# Altium schematic sheet Test.SchDoc
size A4; SheetNumber: 1; SheetTotal: 1
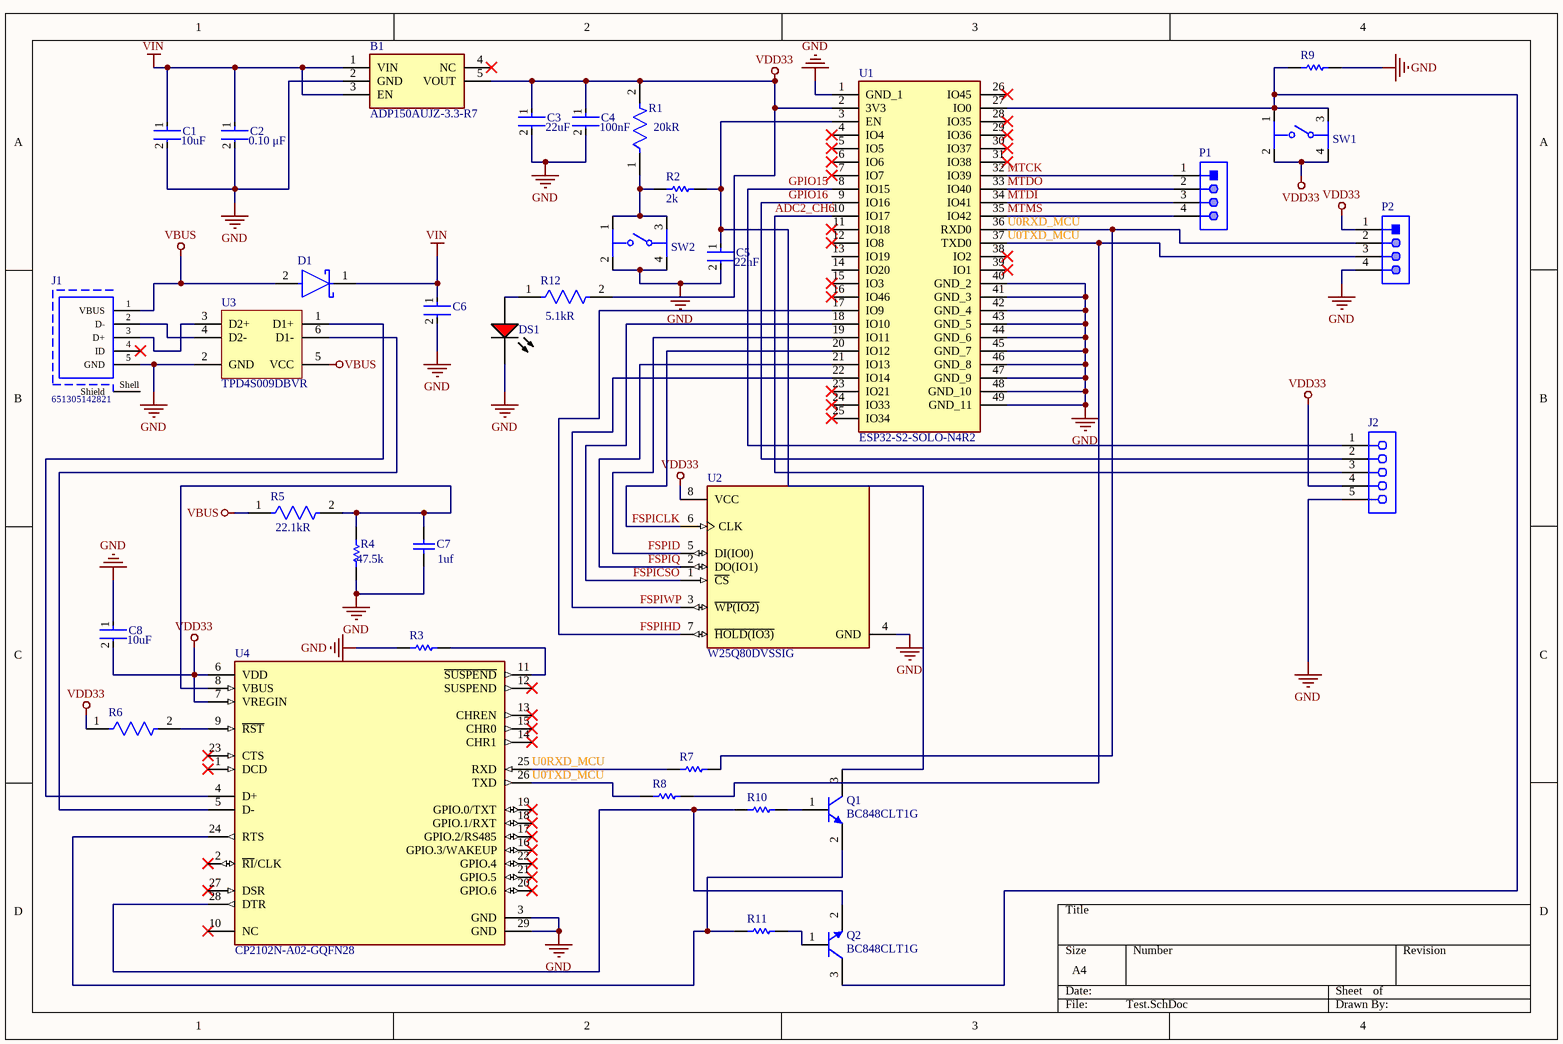
[diagram p0: Test.SchDoc]

## Parts
B1  ADP150AUJZ-3.3-R7  [SOT95P280X100-5N]
C1  Capacitance: 10uF  [FP-GRM21B-0_1-IPC_C]  (hidden comment: GRM21BR61C106KE15L)
C2  Capacitance: 0.10 μF  [FP-C1206C-EB-MFG]  (hidden comment: C1206C104K1RACTU)
C3  Capacitance: 22uF  [FP-GRM21B-0_15-MFG]  (hidden comment: GRM21BR60J226ME39L)
C4  Capacitance: 100nF  [FP-CL03-IPC_B]  (hidden comment: CL03A104KQ3NNNH)
C5  Capacitance: 22nF  [FP-CL21-IPC_A]  (hidden comment: CL21B223KBANNNC)
C6  GRM21BR61E106KA73L  [FP-GRM21B-0_15-IPC_C]  (value not drawn)
C7  value 1uf  [CAPC2013X145X50LL20T25]  (hidden comment: C0805C105K4PACTU)
C8  Capacitance: 10uF  [FP-GRM21B-0_1-IPC_C]  (hidden comment: GRM21BR61C106KE15L)
D1  MSS1P4-M3/89A  [FP-96591-MFG]  (value not drawn)
DS1  TLMS1100-GS08  [VISH-TLMX1100_V]  (value not drawn)
J1  651305142821  [651305142821]
J2  SSW-105-01-G-S  [SMTC-SSW-105-01-X-S]  (value not drawn)
P1  61300411121  [61300411121]  (value not drawn)
P2  61300411121  [61300411121]  (value not drawn)
Q1  BC848CLT1G  [ONSC-SOT-23-3-318-08_V]
Q2  BC848CLT1G  [ONSC-SOT-23-3-318-08_V]
R1  Resistance: 20kR  [FP-AC0603-MFG]  (hidden comment: AC0603FR-0720KL)
R2  Resistance (Ohms): 2k  [RESC1608X55X25LL10T15]  (hidden comment: RC0603FR-072KL)
R3  ERJ3EKF1002V  [RESC1609X55X30LL15T15]  (value not drawn)
R4  value 47.5k  [RESC1609X50X30LL10T20]  (hidden comment: CRCW060347K5FKEA)
R5  Resistance: 22.1kR  [FP-RC0402-0_4-IPC_B]  (hidden comment: RC0402FR-0722K1L)
R6  AC0603FR-071KL  [FP-AC0603-MFG]  (value not drawn)
R7  RC0603JR-070RL  [RESC1608X55X25ML10T15]  (value not drawn)
R8  RC0603JR-070RL  [RESC1608X55X25ML10T15]  (value not drawn)
R9  ERJ3EKF1002V  [RESC1609X55X30LL15T15]  (value not drawn)
R10  ERJ3EKF1002V  [RESC1609X55X30LL15T15]  (value not drawn)
R11  ERJ3EKF1002V  [RESC1609X55X30LL15T15]  (value not drawn)
R12  Resistance: 5.1kR  [FP-CR1206-IPC_B]  (hidden comment: CR1206-FX-5101ELF)
SW1  PTS810 SJG 250 SMTR LFS  [FP-PTS810_SJG_250_SMTR_LF-MFG]  (value not drawn)
SW2  PTS810 SJG 250 SMTR LFS  [FP-PTS810_SJG_250_SMTR_LF-MFG]  (value not drawn)
U1  ESP32-S2-SOLO-N4R2  [ESP32S2SOLON4R2]
U2  W25Q80DVSSIG  [FP-SS-MFG]
U3  TPD4S009DBVR  [DBV0006A_L]
U4  CP2102N-A02-GQFN28  [FP-CP2102N-A02-GQFN28-MFG]

## Nets
GND: B1.2(GND) C1.2 C2.2 C3.2 C4.2 C5.2 C6.2 C7.1 C8.1 DS1.2(K) J1.5(GND) J2.5 P2.4 R3.1 R4.1 R9.2 SW2.2 SW2.4 U1.1(GND_1) U1.40(GND_2) U1.41(GND_3) U1.42(GND_4) U1.43(GND_5) U1.44(GND_6) U1.45(GND_7) U1.46(GND_8) U1.47(GND_9) U1.48(GND_10) U1.49(GND_11) U2.4(GND) U3.2(GND) U4.3(GND) U4.29(GND)
VBUS: D1.2(A) J1.1(VBUS) R5.1 U3.5(VCC)
VDD33: B1.5(VOUT) C3.1 C4.1 C8.2 J2.4 P2.1 R1.2 R6.1 R12.2 SW1.2 SW1.4 U1.2(3V3) U2.8(VCC) U4.6(VDD) U4.7(VREGIN)
VIN: B1.1(VIN) B1.3(EN) C1.1 C2.1 C6.1 D1.1(C)
ADC2_CH6: J2.3 U1.10(IO17)
FSPICLK: U1.20(IO12) U2.6(CLK)
FSPICSO: U1.18(IO10) U2.1(~{CS})
FSPID: U1.19(IO11) U2.5(DI(IO0))
FSPIHD: U1.17(IO9) U2.7(~{HOLD(IO3)})
FSPIQ: U1.21(IO13) U2.2(DO(IO1))
FSPIWP: U1.22(IO14) U2.3(~{WP(IO2)})
GPIO15: J2.1 U1.8(IO15)
GPIO16: J2.2 U1.9(IO16)
MTCK: P1.1 U1.32(IO39)
MTDI: P1.3 U1.34(IO41)
MTDO: P1.2 U1.33(IO40)
MTMS: P1.4 U1.35(IO42)
U0RXD_MCU: P2.2 R7.1 R7.2 U1.36(RXD0) U4.25(RXD)
U0TXD_MCU: P2.3 R8.1 R8.2 U1.37(TXD0) U4.26(TXD)
NetC5_1: C5.1 Q1.3(C) R2.1 U1.3(EN)
NetC7_2: C7.2 R4.2 R5.2 U4.8(VBUS)
NetDS1_1: DS1.1(A) R12.1
NetJ1_2: J1.2(D-) U3.4(D2-)
NetJ1_3: J1.3(D+) U3.3(D2+)
NetQ1_1: Q1.1(B) R10.2
NetQ1_2: Q1.2(E) R11.1 U4.24(RTS)
NetQ2_1: Q2.1(B) R11.2
NetQ2_2: Q2.2(E) R10.1 U4.28(DTR)
NetQ2_3: Q2.3(C) R9.1 SW1.1 SW1.3 U1.27(IO0)
NetR1_1: R1.1 R2.2 SW2.1 SW2.3
NetR3_2: R3.2 U4.11(~{SUSPEND})
NetR6_2: R6.2 U4.9(~{RST})
NetU3_1: U3.1(D1+) U4.4(D+)
NetU3_6: U3.6(D1-) U4.5(D-)

Not connected (* = marked no-connect by the designer): B1 4(NC)*; J1 4(ID)* Shell(Shield); U1 4(IO4)* 5(IO5)* 6(IO6)* 7(IO7)* 11(IO18)* 12(IO8)* 13(IO19) 14(IO20) 15(IO3)* 16(IO46)* 23(IO21)* 24(IO33)* 25(IO34)* 26(IO45)* 28(IO35)* 29(IO36)* 30(IO37)* 31(IO38)* 38(IO2)* 39(IO1)*; U4 1(DCD)* 2(~{RI}/CLK)* 10(NC)* 12(SUSPEND)* 13(CHREN)* 14(CHR1)* 15(CHR0)* 16(GPIO.3/WAKEUP)* 17(GPIO.2/RS485)* 18(GPIO.1/RXT)* 19(GPIO.0/TXT)* 20(GPIO.6)* 21(GPIO.5)* 22(GPIO.4)* 23(CTS)* 27(DSR)*

## Library data of the parts
B1 = ADP150AUJZ-3.3-R7: Ultralow Noise, 150 mA CMOS Linear Regulator; Manufacturer_Name: Analog Devices; Geometry.Height: 1mm; Mouser Part Number: N/A; Mouser Price/Stock: https://www.mouser.com/Search/Refine.aspx?Keyword=N%2FA; Manufacturer_Part_Number: ADP150AUJZ-3.3-R7; Datasheet Link: https://componentsearchengine.com/Datasheets/1/ADP150AUJZ-3.3-R7.pdf
C1 C8 = CMP-2007-03453-2: Chip Multilayer Ceramic Capacitors for General Purpose, 0805, 10uF, X5R, 15%, 10%, 16V; Radiation Hardening: No; Thickness: 0.053inch; Voltage Rating (DC): 16V; Lead Free: Lead Free; Package Quantity: 1; Width: 1.25mm; Case Code (Imperial): 0805; Depth: 1.25mm; Packaging: Tape and Reel; Dielectric: X5R; Max Operating Temperature: 85°C; Tolerance: 10%; Voltage Rating: 16V; Voltage: 16V; Height: 1.25mm; Case Code (Metric): 2012; Material: Ceramic; Mount: Surface Mount; Case/Package: 0805; REACH SVHC: No SVHC; Length: 2mm; Min Operating Temperature: -55°C; Termination: SMD/SMT
C2 = CMP-03020-000153-1: CAP CER 0.1UF 100V X7R 1206; Manufacturer: KEMET; Value: 0.10 μF; Tolerance: 0.1; Material: Ceramic; Temperature Coefficient: 15%; Automotive Grade: Grade 0; Voltage Rating: 100 V; Automotive: Yes; Ipc Land Pattern Name: CAPC320160X78; Device Class L1: Passive Components; ComponentLink2Description: Datasheet; Temperature Range Low: -55°C; Category: Cap; Octopart: https://octopart.com/c1206c104k1ractu-kemet-89521; Height: 0.88mm; Lead Free: Yes; Digikey Description: CAP CER 0.1UF 100V X7R 1206; Mouser Description: CAP CER 0.1UF 100V X7R 1206; Device Class L3: Ceramic Capacitors; Device Class L2: Capacitors; ComponentLink2URL: https://content.kemet.com/datasheets/KEM_C1007_X8R_ULTRA_150C_SMD.pdf; Temperature Range High: +150°C; Temperature Characteristic: X7R; Manufacturer Part Number: C1206C104K1RACTU; RoHS: TRUE; Package: C1206C-EB; Temperature: -55°C to +150°C
C3 = CMP-2007-03385-2: Chip Multilayer Ceramic Capacitors for General Purpose, 0805, 22uF, X5R, 15%, 20%, 6.3V; Material: Ceramic; Max Operating Temperature: 85°C; Voltage: 6.3V; Min Operating Temperature: -55°C; Case/Package: 0805; Thickness: 0.053inch; Dielectric: X5R; Packaging: Tape and Reel; Depth: 1.25mm; Termination: SMD/SMT; Voltage Rating (DC): 6.3V; Radiation Hardening: No; Tolerance: 20%; Mount: Surface Mount; Lead Free: Lead Free; Package Quantity: 1; REACH SVHC: No SVHC; Voltage Rating: 6.3V; Length: 2mm; Case Code (Imperial): 0805; Case Code (Metric): 2012; Width: 0.049inch; Height: 1.25mm
C4 = CMP-13271-001518-1: Cap Ceramic 100nF 6.3V X5R ±10% Pad SMD 0201 +85°C T/R; Case Code (Metric): 0603; Radiation Hardening: No; Height: 0.3mm; Tolerance: 10%; Max Operating Temperature: 85°C; Thickness: 0.013inch; Voltage Rating: 6.3V; Dielectric: X5R; Depth: 0.3mm; Mount: Surface Mount; Min Operating Temperature: -55°C; Width: 0.012inch; Case Code (Imperial): 0201; Packaging: Tape and Reel; Length: 0.6mm; Case/Package: 0201; Package Quantity: 15000
C5 = CMP-13271-002911-1: CL21 Series 0805 22nF 50V ±10% Tolerance X7R Multilayer Ceramic Chip Capacitor; Depth: 1.25mm; Thickness: 0.03inch; Height: 0.65mm; Material: Ceramic; Case/Package: 0805; Voltage Rating (DC): 50V; Contact Plating: Tin; Package Quantity: 1; Case Code (Metric): 2012; Max Operating Temperature: 125°C; Packaging: Tape and Reel; Voltage Rating: 50V; Radiation Hardening: No; Length: 2mm; Mount: Surface Mount; Min Operating Temperature: -55°C; Tolerance: 10%; Case Code (Imperial): 0805; Voltage: 50V; Dielectric: X7R; Lead Free: Lead Free; Width: 0.049inch
C6 = CMP-2007-03541-2: Chip Multilayer Ceramic Capacitors for General Purpose, 0805, 10uF, X5R, 15%, 10%, 25V; Length: 2mm; Depth: 1.25mm; Termination: SMD/SMT; Voltage: 25V; Height: 1.25mm; Material: Ceramic; Thickness: 0.053inch; Radiation Hardening: No; Min Operating Temperature: -55°C; Width: 0.049inch; Package Quantity: 1; Mount: Surface Mount; Dielectric: X5R; Packaging: Tape and Reel; Capacitance: 10uF; Voltage Rating (DC): 25V; Lead Free: Lead Free; Max Operating Temperature: 85°C; Case Code (Imperial): 0805; Case/Package: 0805; Tolerance: 10%; Voltage Rating: 25V; Case Code (Metric): 2012
C7 = CMP-1036-04746-2: Manufacturer: Kemet; Part Number: C0805C105K4PACTU
D1 = CMP-02539-000019-1: DIODE SCHOTTKY 40V 1A MICROSMP; Manufacturer: Vishay; Value: 50pF; Peak Reverse Current: 8.5uA; Max Junction Temp: +150°C; Max Surge Forward Current: 25A; Mouser Description: Schottky Diodes & Rectifiers 1.0 Amp 40 Volt; Category: Diode; Height: 0.73mm; Temperature Range High: +150°C; Temperature Range Low: -55°C; ComponentLink2URL: http://www.vishay.com/docs/89019/mss1p4.pdf; Forward Current: 1A; Device Class L1: Discrete Semiconductors; Lead Free: Yes; Octopart: https://octopart.com/mss1p4-m3%2F89a-vishay-42505723; ComponentLink2Description: Datasheet; Digikey Description: DIODE SCHOTTKY 40V 1A MICROSMP; Footprint Url: http://www.vishay.com/docs/96591/microsmp_do-219ad_fredpt.pdf; Package: 96591; Temperature: -55°C to +150°C; Device Class L2: Diodes; Manufacturer Part Number: MSS1P4-M3/89A; Automotive: No; RoHS: TRUE; Device Class L3: Schottky Diodes; Capacitance: 50pF; Max Repetitive Reverse Voltage: 40V
DS1 = CMP-1666-00027-1: LED, RED, 2.1 V, -40 to 100 degC, 2-Pin SMD (0603), RoHS, Tape and Reel; Type (Capacitors): C0G; Resistance: 100000000000 Ohm; Capacitance: 12 pF; Voltage Rating: 50 V; Tolerance: 5%; Min Operating Temperature: -55degC; REACH SVHC: No SVHC; ComponentLink2Description: Datasheet; ComponentLink1URL: http://www.vishay.com/; Width: 0.8 mm; Package Quantity: 4000; PackageReference: TLMX1100; ComponentLink2URL: http://www.vishay.com/docs/83173/tlmb1100.pdf; Case/Package: 0603; Case Code (Metric): 1608; Packaging: Tape and Reel; Pins: 2; ComponentLink1Description: Manufacturer URL; Max Operating Temperature: 125degC; Height: 0.8 mm; Length: 1.6 mm; Mount: Surface Mount; PackageDescription: 2-Pin Surface Mount Device, Body 1.6 x 0.8 mm; DatasheetVersion: Rev. 2.7, 03/2016; Case Code (Imperial): 0603; Voltage Rating (DC): 50 V; RoHSCompliant: True; Radiation Hardening: No
J1 = CMP-1502-03247-1: Mini USB 2.0 Type AB Receptacle WR-COM, Horizontal, SMT, with Pads; Manufacturer: Wurth Elektronik; Rated Current: 1A; Contact Resistance: 20mOhm; Working Voltage: 30VAC; Publisher: WurthElektronik; Connector Type: MiniUSB2.0TypeAB; Manufacturer URL: http://www.we-online.de; Part Number: 651305142821; Packaging: TapeandReel; Gender: Receptacle; Package Reference: 651305142821; Datasheet URL: https://katalog.we-online.de/em/datasheet/651305142821.pdf; Operating Temperature: -40to105degC; Mounting Technology: SMT; Orientation: Horizontal
J2 = CMP-1023-00344-1: SQ Post Socket, Through-hole, Vertical, -55 to 125 degC, 2.54mm Pitch, 5-Pin, Female, RoHS; Manufacturer: Samtec; RoHS: True; Pitch: 2.54 mm; DatasheetVersion: F-214; ComponentLink3Description: Package Specification; ComponentLink2Description: Datasheet; ComponentLink3URL: http://www.samtec.com/documents/webfiles/cpdf/SSW-1XX-XX-XXX-X-XX-XXX-XX-MKT.pdf; Temperature Range: -55 to 125 degC; PackageDescription: Assembly, Socket Strip .016 X .031 Tail; ComponentLink1URL: http://www.samtec.com; PackageVersion: CA, 6/1987; ComponentLink1Description: Manufacturer URL; PartNumber: SSW-105-01-G-S; Orientation: Vertical; ComponentLink2URL: http://www.samtec.com/documents/webfiles/pdf/SSW_TH.PDF; Mounting Technology: Through-hole; PackageReference: SSW-105-01-X-S
P1 P2 = CMP-1502-01064-1: THT Vertical Pin Header WR-PHD, Pitch 2.54 mm, Single Row, 4 pins; Manufacturer: Wurth Elektronik; Withstanding Voltage: 500VAC; Rated Current: 3A; Working Voltage: 250VAC; Pin Number: 4; Gender: Male; Contact Resistance: 20mOhm; Pitch: 2.54mm; Manufacturer URL: http://www.we-online.de; Operating Temperature: -40to105degC; Packaging: Bag; Mounting Technology: THT; Package Reference: 61300411121; Datasheet URL: https://katalog.we-online.de/em/datasheet/6130xx11121.pdf; Publisher: WurthElektronik; Part Number: 61300411121; Row Number: Single; Orientation: Vertical
Q1 Q2 = CMP-1048-00721-1: General Purpose Transistor, NPN Silicon, 3-Pin SOT-23, Pb-Free, Tape and Reel; Manufacturer: On Semiconductor; fT Min (MHz): 100; IC Continuous (A): 0.1; Packing: Tape and Reel; ComponentLink1Description: Manufacturer URL; ComponentLink2URL: http://www.onsemi.cn/pub_link/Collateral/BC846ALT1-D.PDF; PartNumber: BC848CLT1G; PackageDescription: 3-Pin Small Outline Transistor, Body 2.92 x 1.3 mm, Pitch 0.95 mm; RoHS: TRUE; PackageReference: SOT-23-3-318-08; DatasheetVersion: Rev. 11; Mounting Technology: Surface Mount; PackageVersion: Rev. AP, 11/2009; ComponentLink3Description: Package Specification; ComponentLink1URL: http://www.onsemi.com/; ComponentLink2Description: Datasheet; Polarity: NPN; ComponentLink3URL: http://www.onsemi.cn/pub_link/Collateral/318-08.PDF
R1 = CMP-2000-04831-3: RES 20KΩ 1.00% 0.1W 0603; Power Rating: 100mW; Temperature Coefficient: 100ppm/°C; Tolerance: 1%; Voltage Rating: 50V; Width: 0.8mm; Case Code (Metric): 1608; Max Operating Temperature: 155°C; Ratings: AEC-Q200; Min Operating Temperature: -55°C; Number of Terminations: 2; RoHS Compliant: Yes; Resistor Type: Thick Film; Height: 0.45mm; Lead Free: Lead Free; Max Power Dissipation: 100mW; Case Code (Imperial): 0603; Case/Package: 0603; Length: 1.6mm; Features: Moisture Resistant; Series: AC; Termination: SMD/SMT; Packaging: Tape and Reel
R2 = CMP-2000-06937-1: Chip Resistor, 2 KOhm, +/- 1%, 50 V, -55 to 155 degC, 0603 (1608 Metric), RoHS, Tape and Reel; Manufacturer: Yageo; PCN Other: RC/AC0603/0805/120622/Jan/2013; Catalog Drawings: ThickFilmResistorTopThickFilmResistorSide; Kits: PHH4-KIT-ND-RESKIT1K-9.76K1/10W5700PCS; EDA / CAD Models: DownloadfromAcceleratedDesigns; HTML Datasheet: RCSeries,LSuffixDatasheet.html; Power (Watts): 0.1W,1/10W; Other Names: 311-2.00KHRCT; Temperature Coefficient: ±100ppm/°C; Online Catalog: RC0603Series; Features: MoistureResistant; Height: 0.022"(0.55mm); Size / Dimension: 0.063"Lx0.031"W(1.60mmx0.80mm); Product Training Modules: ChipResistor; Mounting Technology: SurfaceMount; Package / Case: 0603(1608Metric); Supplier Device Package: 0603; Category: Resistors; Tolerance: ±1%; Packaging: CutTape(CT); Operating Temperature: -55°C~155°C; Standard Package: 1; Series: RC; Datasheet URL: http://www.yageo.com/documents/recent/PYu-RC_Group_51_RoHS_L_7.pdf; Package Description: 2-Pin Surface Mount Device, Body 1.6 x 0.8 mm; Number of Terminations: 2; Datasheet Version: Rev. 7, 05/2017; Package Reference: 0603; Composition: ThickFilm; Manufacturer URL: http://www.yageo.com/; Family: ChipResistor-SurfaceMount
R3 R9-R11 = CMP-1012-00623-3: Chip Resistor, 10 KOhm, +/- 1%, 0.1 W, -55 to 155 degC, 0603 (1608 Metric), RoHS, Tape and Reel; Manufacturer: Panasonic; Voltage Rating: 75V; Case\/Package: 0603; Power Rating: 100mW; Resistance: 10KOhm; Temperature Coefficient: 100ppm\/degreesC; Number of Pins: 2; Package Reference: 603; Depth: 0.8mm; Mount: SurfaceMount; Package Description: 2-Pin Surface Mount Device, Body 1.6 x 0.85 mm; Datasheet Version: 02/2017; Length: 1.6mm; Lead Free: LeadFree; Height: 0.45mm; Number of Terminations: 2; Max Power Dissipation: 100mW; Min Operating Temperature: -55degC; Datasheet URL: https://industrial.panasonic.com/cdbs/www-data/pdf/RDA0000/AOA0000C304.pdf; Termination: SMD/SMT; Case Code (Metric): 1608; Case Code (Imperial): 0603; Tolerance: 1%; Max Operating Temperature: 155degC; RoHSCompliant: true; Voltage Rating (DC): 75V; Radiation Hardening: No; Packaging: TapeandReel; Composition: ThickFilm; Mounting Technology: SurfaceMount; Manufacturer URL: http://www.panasonic.com/; Width: 0.031inch; REACH SVHC: NoSVHC; Contact Plating: Tin; Military Standard: Not; Package Quantity: 1
R4 = CMP-1012-00700-2: Manufacturer: Vishay Dale; Part Number: CRCW060347K5FKEA
R5 = CMP-2002-07515-2: RES 22.1K OHM 1% 1/16W 0402; Max Power Dissipation: 63mW; Working Voltage: 50V; Temperature Coefficient: 100ppm/°C; Power Rating: 62.5mW; Width: 0.02inch; Height: 0.016inch; Resistor Type: Thick Film; Length: 0.039inch; Construction: Rectangular; RoHS Compliant: Yes; Depth: 0.5mm; Max Operating Temperature: 155°C; Termination: SMD/SMT; Case Code (Imperial): 0402; Lead Free: Lead Free; Min Operating Temperature: -55°C; Resistance Tolerance: 1%; Features: Moisture Resistant; Voltage Rating (DC): 50V; Military Standard: Not; Packaging: Tape and Reel; Technology: THICK FILM; Voltage Rating: 50V; Tolerance: 1%; Case/Package: 0402; REACH SVHC: No SVHC; Number of Terminations: 2; Package Quantity: 1; Series: RC; Case Code (Metric): 1005
R6 = CMP-2000-04828-3: RES 1kΩ 1.00% 0.1W 0603; Voltage Rating: 50V; Power Rating: 100mW; Tolerance: 1%; Temperature Coefficient: 100ppm/°C; Resistance: 1kR; Depth: 0.8mm; Case/Package: 0603; Size Code: 0603; Case Code (Metric): 1608; Height: 0.022inch; Series: AC; Width: 0.031inch; Construction: Rectangular; Length: 0.063inch; Case Code (Imperial): 0603; Package Quantity: 1; RoHS Compliant: Yes; Features: Moisture Resistant; Resistor Type: Thick Film; Max Power Dissipation: 100mW; Packaging: Tape and Reel; Termination: SMD/SMT; Ratings: AEC-Q200; Max Operating Temperature: 155°C; Min Operating Temperature: -55°C; Military Standard: Not; Lead Free: Lead Free; Number of Terminations: 2
R7 R8 = CMP-2100-03667-1: Chip Resistor, 0 Ohm, +/- 5%, 0.1 W, -55 to 155 degC, 0603 (1608 Metric), RoHS, Tape and Reel; Manufacturer: Yageo; Temperature Coefficient: 200ppm/degreesC; Voltage Rating: 50V; Power Rating: 100mW; Resistance: 0mOhm; Width: 0.8mm; Max Operating Temperature: 155degC; Tolerance: 5%; Package Reference: 0603; Height: 0.45mm; Depth: 0.8mm; Package Description: 2-Pin Surface Mount Device, Body 1.6 x 0.8 mm; Termination: SMD/SMT; Package Quantity: 5000; Case/Package: 0603; Case Code (Imperial): 0603; Radiation Hardening: No; Number of Pins: 2; Length: 1.6mm; Lead Free: LeadFree; Voltage Rating (DC): 50V; Military Standard: Not; Datasheet URL: http://www.yageo.com/NewPortal/yageodocoutput?fileName=/pdf/R-Chip/PYu-RC_Group_51_RoHS_L_5.pdf; Manufacturer URL: http://www.yageo.com/; Packaging: TapeandReel; Case Code (Metric): 1608; Min Operating Temperature: -55degC; Composition: ThickFilm; RoHSCompliant: true; Contact Plating: Tin; Datasheet Version: Rev. 5, 10/2016; REACH SVHC: NoSVHC
R12 = CMP-07231-005130-1: Thick Film Chip Resistors 1206 5.1kΩ 0.25W 1% 100ppm/°C; Voltage Rating: 200V; Max Power Dissipation: 250mW; Min Operating Temperature: -55°C; Length: 3.2mm; Mount: Surface Mount; Tolerance: 1%; Military Standard: Not; Radiation Hardening: No; Case Code (Imperial): 1206; Composition: Thick Film; Max Operating Temperature: 155°C; Thickness: 610um; Height: 0.03inch; Features: Moisture Resistant; Number of Terminations: 2; Packaging: Tape and Reel; Termination: SMD/SMT; Case Code (Metric): 3216; Temperature Coefficient: 100ppm/°C; Contact Plating: Tin; Package Quantity: 1; Width: 0.063inch; Depth: 1.6mm; Power Rating: 250mW; Case/Package: 1206
SW1 SW2 = CMP-10040-000011-1: SWITCH TACTILE SPST-NO 0.05A 16V; Manufacturer: C&K Components; Electromechanical Life: 100000Cycles; Contact Resistance: 500mΩ; Operating Force: 400gf; Current Rating: 50mA; Voltage Rating Dc: 16V; Device Class L2: Switches; Device Class L1: Electromechanical; ComponentLink2URL: https://www.ckswitches.com/media/1476/pts810.pdf; Digikey Description: SWITCH TACTILE SPST-NO 0.05A 16V; RoHS: TRUE; Temperature Range Low: -40°C; Temperature Range High: +85°C; Automotive: No; Category: Switch; ComponentLink2Description: Datasheet; Device Class L3: Tactile Switches; Mouser Description: Switch Tactile N.O. SPST Button J-Bend 0.05A 16VDC 100000Cycles 3.92N SMD T/R; Throw Configuration: SPST-NO; Package: PTS810 SJG 250 SMTR LFS; Height: 2.7mm; Octopart: https://octopart.com/pts810sjg250smtrlfs-c%26k+components-29380277; Manufacturer Part Number: PTS810 SJG 250 SMTR LFS; Temperature: -40°C to +85°C; Lead Free: Yes
U1 = ESP32-S2-SOLO-N4R2: WiFi Modules - 802.11 SMD module, ESP32-S2R2 with 2 MB PSRAM inside, 4 MB SPI flash, PCB antenna/002; Manufacturer_Name: Espressif Systems; Geometry.Height: 3.25mm; Mouser Part Number: 356-ESP32-S2SOLON4R2; Mouser Price/Stock: https://www.mouser.co.uk/ProductDetail/Espressif-Systems/ESP32-S2-SOLO-N4R2?qs=pBJMDPsKWf0j4qPDQHWJuA%3D%3D; Manufacturer_Part_Number: ESP32-S2-SOLO-N4R2; Datasheet Link: https://www.espressif.com/sites/default/files/documentation/esp32-s2-solo_esp32-s2-solo-u_datasheet_en.pdf
U2 = CMP-2000-07408-2: IC FLASH 8MBIT SPI 104MHZ 8SOIC; Memory Type: Non-Volatile; Memory Size: 8Mb; Frequency: 104MHz; Min Operating Temperature: -40°C; Mount: Surface Mount; RoHS Compliant: Yes; Packaging: Rail/Tube; Case/Package: SOIC; Max Operating Temperature: 85°C; Series: SpiFlash®; Interface: SPI
U3 = CMP-0326-00056-3: ESD Solution for High-Speed Differential Interface, 4 Channels, -40 to +85 degC, 6-pin SOT-32 (DBV), Green (RoHS & no Sb/Br); Manufacturer: Texas Instruments; IEC 61000-4-2 Air-Gap(+/- kV): 9; Differential Capacitance(pF): 0.05; IEC 61000-4-2 Contact(+/- kV): 8; IO Leakage Current(nA): 10; IO Capacitance(Typ)(pF): 0.8; PartNumber: TPD4S009DBVR; PackageReference: DBV0006A; ComponentLink1Description: Manufacturer URL; SubFamily: ESD Solution; ComponentLink2URL: http://www.ti.com/general/docs/lit/getliterature.tsp?genericPartNumber=TPD4S009&fileType=pdf; ComponentLink2Description: Datasheet; DatasheetVersion: SLVS817E; ComponentLink1URL: http://www.ti.com/; ComponentLink3URL: SamplesURL:http://www.ti.com/product/tpd4s009#samples; PackageVersion: revK, Mar-2006; PackageDescription: 6-Pin Plastic Small-Outline Package, 2.9 x 1.6 mm Body, 0.95 mm Pitch, 2.8 mm Lead Span; ComponentLink3Description: URL Link1; Breakdown Voltage(Min)(V): 9; Eco-Plan: Green (RoHS & no Sb/Br); Mounting Technology: Surface Mount
U4 = CMP-08093-000005-1: IC USB TO UART BRIDGE QFN28